# Altium schematic sheet SINUX_F1_MAIN.SchDoc
size A
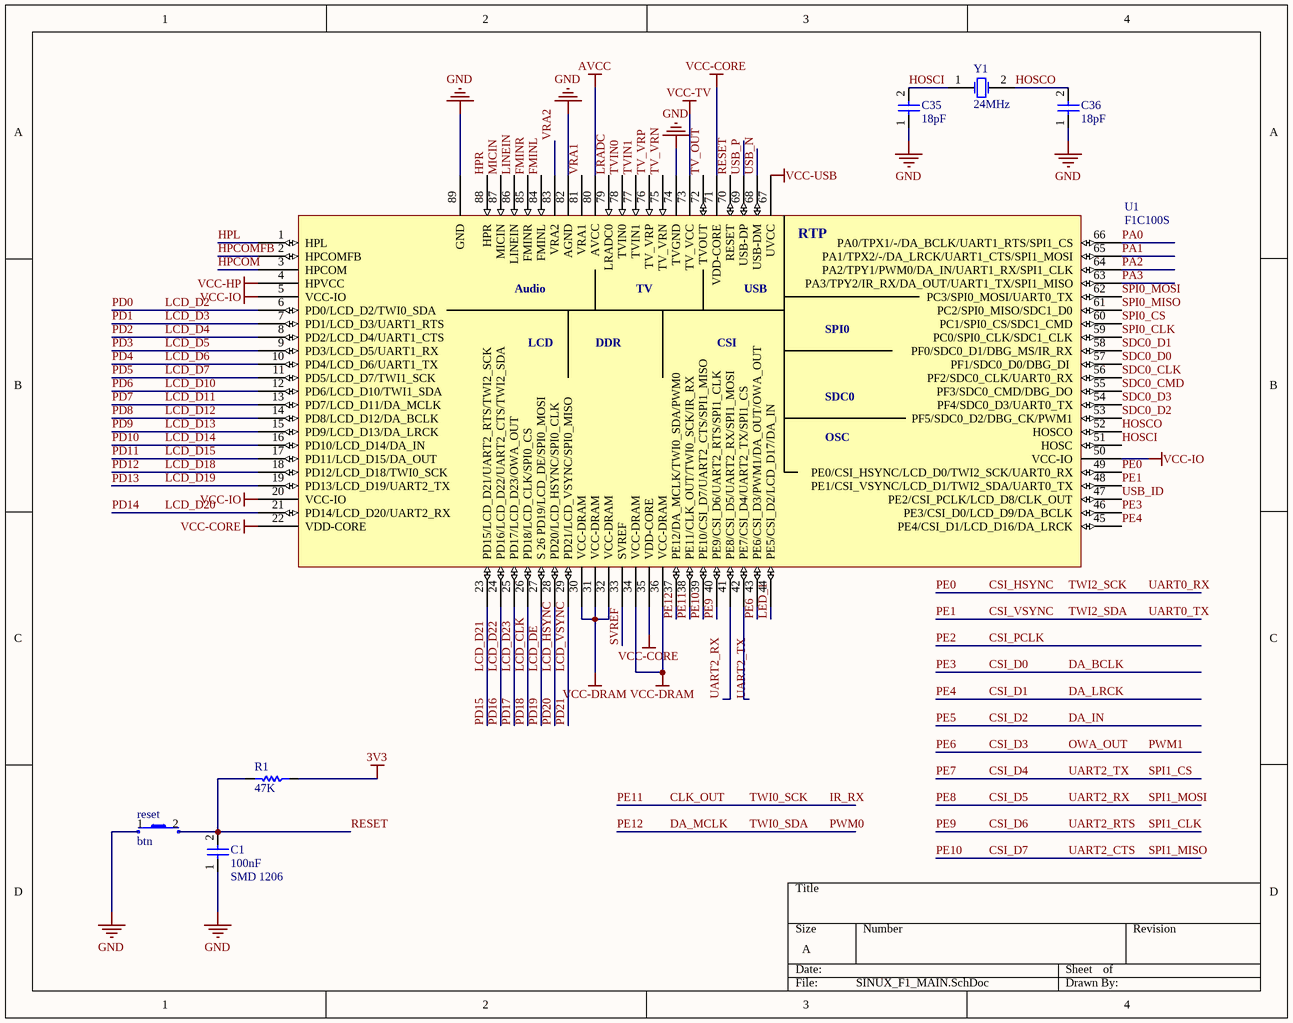
[diagram p0: SINUX_F1_MAIN.SchDoc]

## Parts
C1  100nF  [SMD 0805]
C35  18pF  [SMD 0805]
C36  18pF  [SMD 0805]
R1  47K  [0805_1/8W]
reset  btn  [btn]
U1  F1C100S  [QFN40P1000X1000X90-89N]
Y1  24MHz  [XTAL  SMD]

## Nets
3V3: R1.1
AVCC: U1.80(AVCC)
GND: C1.1 C35.1 C36.1 reset.1 U1.74(TVGND) U1.82(AGND) U1.89(GND)
VCC-CORE: U1.22(VDD-CORE) U1.35(VDD-CORE) U1.71(VDD-CORE)
VCC-DRAM: U1.30(VCC-DRAM) U1.31(VCC-DRAM) U1.32(VCC-DRAM) U1.34(VCC-DRAM) U1.36(VCC-DRAM)
VCC-HP: U1.4(HPVCC)
VCC-IO: U1.5(VCC-IO) U1.20(VCC-IO) U1.50(VCC-IO)
VCC-TV: U1.73(TV_VCC)
VCC-USB: U1.67(UVCC)
CLK_OUT: U1.38(PE11/CLK_OUT/TWI0_SCK/IR_RX)  [also labelled IR_RX, PE11, TWI0_SCK]
CSI_D0: U1.46(PE3/CSI_D0/LCD_D9/DA_BCLK)  [also labelled DA_BCLK, PE3]
CSI_D1: U1.45(PE4/CSI_D1/LCD_D16/DA_LRCK)  [also labelled DA_LRCK, PE4]
CSI_D3: U1.43(PE6/CSI_D3/PWM1/DA_OUT/OWA_OUT)  [also labelled OWA_OUT, PE6, PWM1]
CSI_D4: U1.42(PE7/CSI_D4/UART2_TX/SPI1_CS)  [also labelled PE7, SPI1_CS, UART2_TX]
CSI_D5: U1.41(PE8/CSI_D5/UART2_RX/SPI1_MOSI)  [also labelled PE8, SPI1_MOSI, UART2_RX]
CSI_D6: U1.40(PE9/CSI_D6/UART2_RTS/SPI1_CLK)  [also labelled PE9, SPI1_CLK, UART2_RTS]
CSI_D7: U1.39(PE10/CSI_D7/UART2_CTS/SPI1_MISO)  [also labelled PE10, SPI1_MISO, UART2_CTS]
CSI_HSYNC: U1.49(PE0/CSI_HSYNC/LCD_D0/TWI2_SCK/UART0_RX)  [also labelled PE0, TWI2_SCK, UART0_RX]
CSI_VSYNC: U1.48(PE1/CSI_VSYNC/LCD_D1/TWI2_SDA/UART0_TX)  [also labelled PE1, TWI2_SDA, UART0_TX]
DA_MCLK: U1.37(PE12/DA_MCLK/TWI0_SDA/PWM0)  [also labelled PE12, PWM0, TWI0_SDA]
FMINL: U1.84(FMINL)
FMINR: U1.85(FMINR)
HOSCI: C35.2 U1.51(HOSC) Y1.1(OSC1)
HOSCO: C36.2 U1.52(HOSCO) Y1.2(OSC2)
HPCOM: U1.3(HPCOM)
HPCOMFB: U1.2(HPCOMFB)
HPL: U1.1(HPL)
HPR: U1.88(HPR)
LCD_CLK: U1.26(PD18/LCD_CLK/SPI0_CS)  [also labelled PD18]
LCD_D2: U1.6(PD0/LCD_D2/TWI0_SDA)  [also labelled PD0]
LCD_D3: U1.7(PD1/LCD_D3/UART1_RTS)  [also labelled PD1]
LCD_D4: U1.8(PD2/LCD_D4/UART1_CTS)  [also labelled PD2]
LCD_D5: U1.9(PD3/LCD_D5/UART1_RX)  [also labelled PD3]
LCD_D6: U1.10(PD4/LCD_D6/UART1_TX)  [also labelled PD4]
LCD_D7: U1.11(PD5/LCD_D7/TWI1_SCK)  [also labelled PD5]
LCD_D10: U1.12(PD6/LCD_D10/TWI1_SDA)  [also labelled PD6]
LCD_D11: U1.13(PD7/LCD_D11/DA_MCLK)  [also labelled PD7]
LCD_D12: U1.14(PD8/LCD_D12/DA_BCLK)  [also labelled PD8]
LCD_D13: U1.15(PD9/LCD_D13/DA_LRCK)  [also labelled PD9]
LCD_D14: U1.16(PD10/LCD_D14/DA_IN)  [also labelled PD10]
LCD_D15: U1.17(PD11/LCD_D15/DA_OUT)  [also labelled PD11]
LCD_D18: U1.18(PD12/LCD_D18/TWI0_SCK)  [also labelled PD12]
LCD_D19: U1.19(PD13/LCD_D19/UART2_TX)  [also labelled PD13]
LCD_D20: U1.21(PD14/LCD_D20/UART2_RX)  [also labelled PD14]
LCD_D21: U1.23(PD15/LCD_D21/UART2_RTS/TWI2_SCK)  [also labelled PD15]
LCD_D22: U1.24(PD16/LCD_D22/UART2_CTS/TWI2_SDA)  [also labelled PD16]
LCD_D23: U1.25(PD17/LCD_D23/OWA_OUT)  [also labelled PD17]
LCD_DE: U1.27(S_26_PD19/LCD_DE/SPI0_MOSI)  [also labelled PD19]
LCD_HSYNC: U1.28(PD20/LCD_HSYNC/SPI0_CLK)  [also labelled PD20]
LCD_VSYNC: U1.29(PD21/LCD_VSYNC/SPI0_MISO)  [also labelled PD21]
LED_1: U1.44(PE5/CSI_D2/LCD_D17/DA_IN)
LINEIN: U1.86(LINEIN)
LRADC: U1.79(LRADC0)
MICIN: U1.87(MICIN)
PA0: U1.66(PA0/TPX1/-/DA_BCLK/UART1_RTS/SPI1_CS)
PA1: U1.65(PA1/TPX2/-/DA_LRCK/UART1_CTS/SPI1_MOSI)
PA2: U1.64(PA2/TPY1/PWM0/DA_IN/UART1_RX/SPI1_CLK)
PA3: U1.63(PA3/TPY2/IR_RX/DA_OUT/UART1_TX/SPI1_MISO)
RESET: C1.2 R1.2 reset.2 U1.70(RESET)
SDC0_CLK: U1.56(PF2/SDC0_CLK/UART0_RX)
SDC0_CMD: U1.55(PF3/SDC0_CMD/DBG_DO)
SDC0_D0: U1.57(PF1/SDC0_D0/DBG_DI)
SDC0_D1: U1.58(PF0/SDC0_D1/DBG_MS/IR_RX)
SDC0_D2: U1.53(PF5/SDC0_D2/DBG_CK/PWM1)
SDC0_D3: U1.54(PF4/SDC0_D3/UART0_TX)
SPI0_CLK: U1.59(PC0/SPI0_CLK/SDC1_CLK)
SPI0_CS: U1.60(PC1/SPI0_CS/SDC1_CMD)
SPI0_MISO: U1.61(PC2/SPI0_MISO/SDC1_D0)
SPI0_MOSI: U1.62(PC3/SPI0_MOSI/UART0_TX)
SVREF: U1.33(SVREF)
TV_OUT: U1.72(TVOUT)
TV_VRN: U1.75(TV_VRN)
TV_VRP: U1.76(TV_VRP)
TVIN0: U1.78(TVIN0)
TVIN1: U1.77(TVIN1)
USB_ID: U1.47(PE2/CSI_PCLK/LCD_D8/CLK_OUT)
USB_N: U1.68(USB-DM)
USB_P: U1.69(USB-DP)
VRA1: U1.81(VRA1)
VRA2: U1.83(VRA2)

## Notes on the sheet
- (in symbol CAP NON) SMD 1206
- (in symbol F1C100S) RTP; Audio; TV; USB; SPI0; LCD; DDR; CSI; SDC0; OSC

## Library data of the parts
C1 = CAP NON
C35 C36 = CAP NON: Capacitor; Manufacturer Part Number 1: 10uF; Supplier 1: SMD-0805
R1 = RESISTOR
Y1 = XTAL